# EAGLE design LoRa_Sensor (EAGLE 9.6.2)
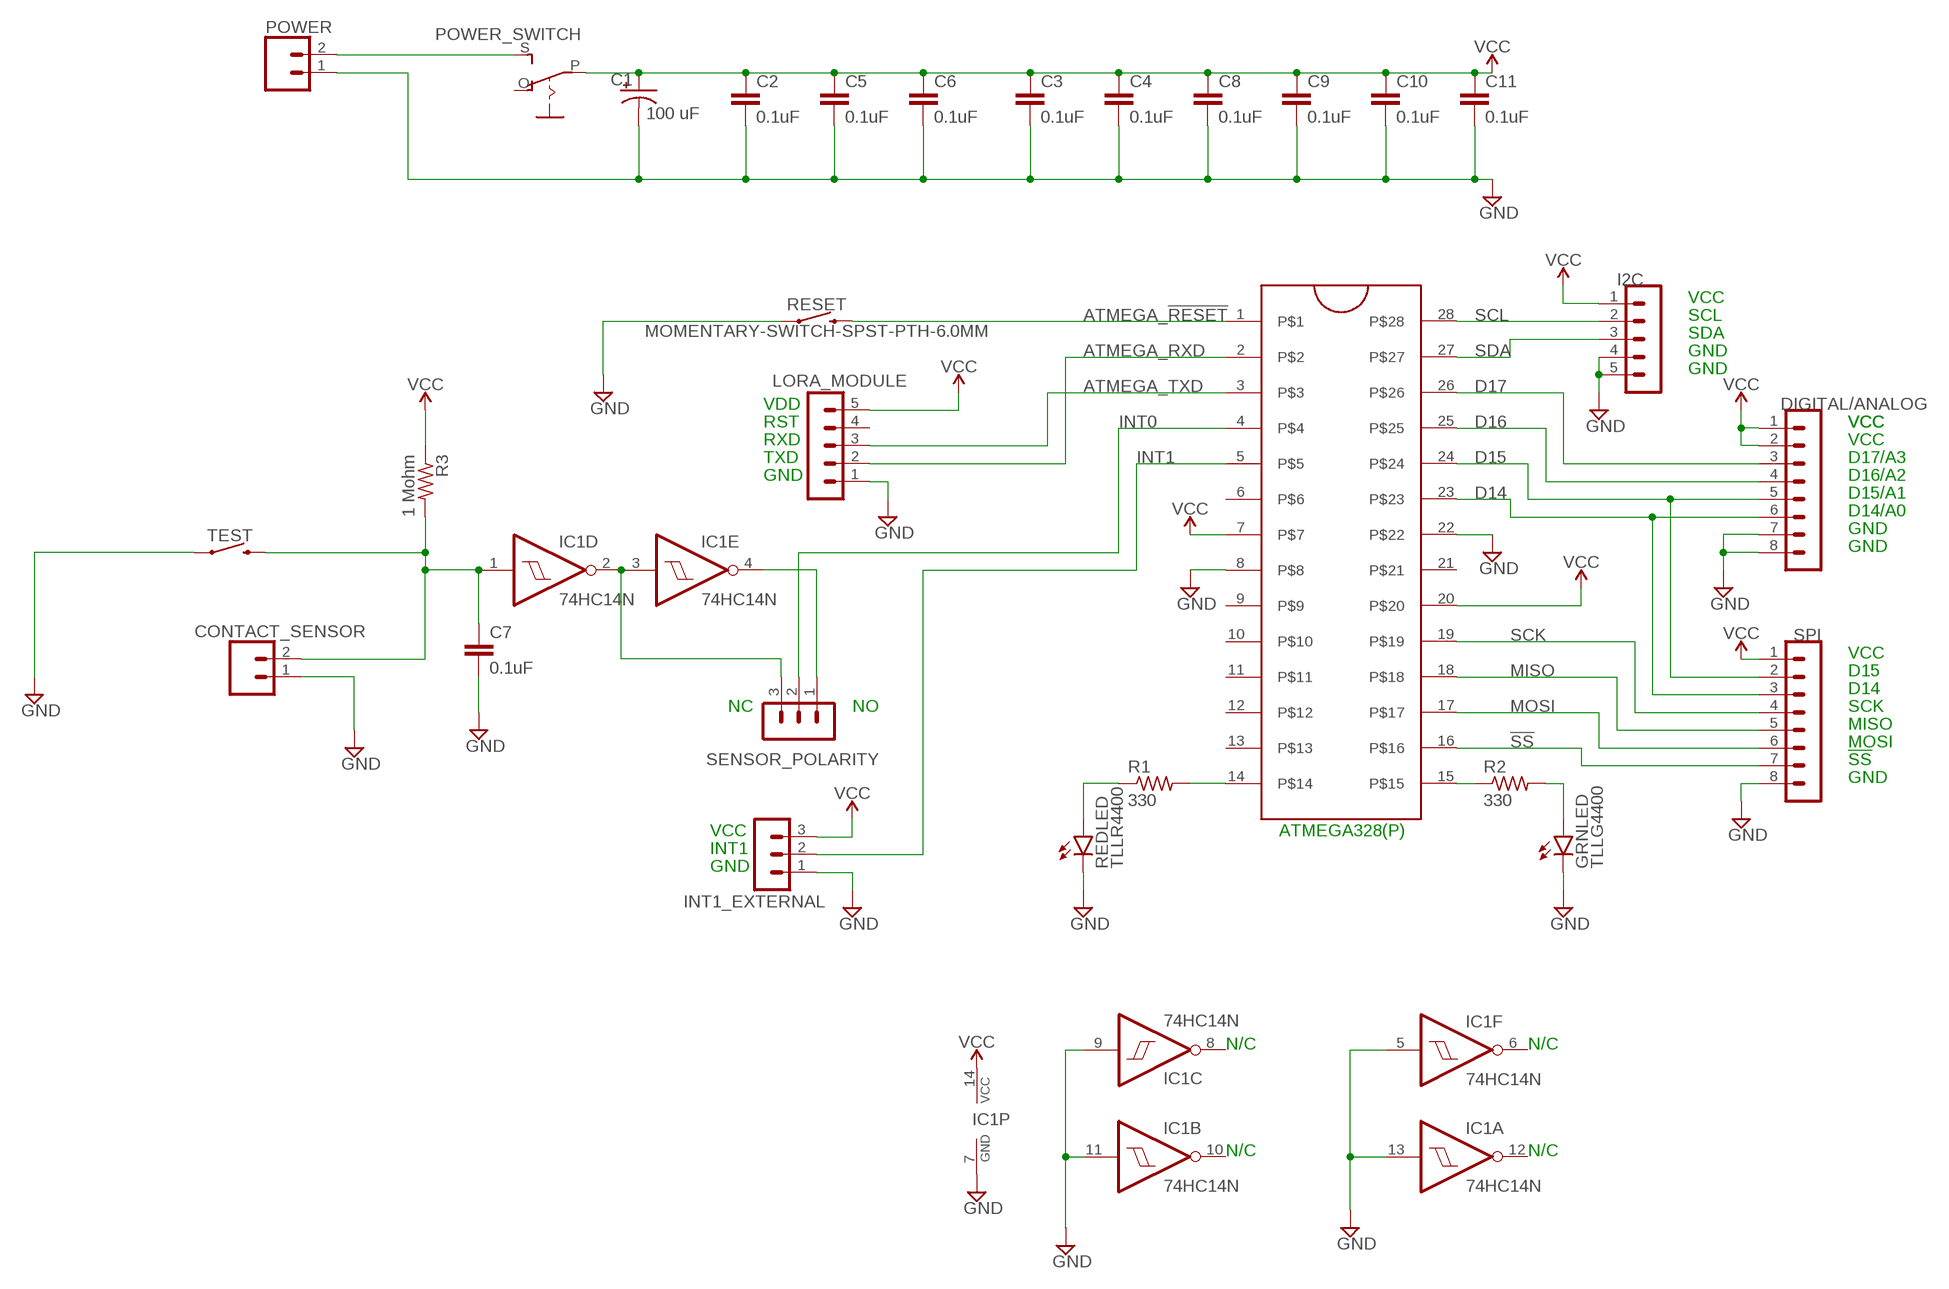
[diagram p0: schematic, sheet 1]

## Parts
C1  100 uF  CPOL-USE2.5-6  [E2,5-6]
C2  0.1uF  0.1UF-KIT-EZ-50V-20%  [CAP-PTH-SMALL-KIT]
C3  0.1uF  0.1UF-KIT-EZ-50V-20%  [CAP-PTH-SMALL-KIT]
C4  0.1uF  0.1UF-KIT-EZ-50V-20%  [CAP-PTH-SMALL-KIT]
C5  0.1uF  0.1UF-KIT-EZ-50V-20%  [CAP-PTH-SMALL-KIT]
C6  0.1uF  0.1UF-KIT-EZ-50V-20%  [CAP-PTH-SMALL-KIT]
C7  0.1uF  0.1UF-KIT-EZ-50V-20%  [CAP-PTH-SMALL-KIT]
C8  0.1uF  0.1UF-KIT-EZ-50V-20%  [CAP-PTH-SMALL-KIT]
C9  0.1uF  0.1UF-KIT-EZ-50V-20%  [CAP-PTH-SMALL-KIT]
C10  0.1uF  0.1UF-KIT-EZ-50V-20%  [CAP-PTH-SMALL-KIT]
C11  0.1uF  0.1UF-KIT-EZ-50V-20%  [CAP-PTH-SMALL-KIT]
CONTACT_SENSOR  CONN_023.5MM  [SCREWTERMINAL-3.5MM-2]
DIGITAL/ANALOG  MA08-1  [MA08-1]
GRNLED  TLLG4400  [LED3MM]
I2C  MA05-1  [MA05-1]
IC1  74HC14N  [DIL14]
INT1_EXTERNAL  MA03-1  [MA03-1]
J1  ZIFSOCKET-28-3"  [DIL28-3-ZIF_SOCKET]
LORA_MODULE  MA05-1  [MA05-1]
POWER  CONN_023.5MM  [SCREWTERMINAL-3.5MM-2]
POWER_SWITCH  EG1218S  [EG1218]
R1  330  R-US_0309/12  [0309/12]
R2  330  R-US_0309/12  [0309/12]
R3  1 Mohm  R-US_0309/12  [0309/12]
REDLED  TLLR4400  [LED3MM]
RESET  MOMENTARY-SWITCH-SPST-PTH-6.0MM  [TACTILE_SWITCH_PTH_6.0MM]
SENSOR_POLARITY  MA03-1  [MA03-1]
SPI  MA08-1  [MA08-1]
TEST  MOMENTARY-SWITCH-SPST-PTH-6.0MM  [TACTILE_SWITCH_PTH_6.0MM]

## Nets
!SS: J1.16 SPI.7
ATMEGA_!RESET: J1.1 RESET.3
ATMEGA_RXD: J1.2 LORA_MODULE.2
ATMEGA_TXD: J1.3 LORA_MODULE.3
D14: DIGITAL/ANALOG.6 J1.23 SPI.3
D15: DIGITAL/ANALOG.5 J1.24 SPI.2
D16: DIGITAL/ANALOG.4 J1.25
D17: DIGITAL/ANALOG.3 J1.26
GND: C1.- C2.2 C3.2 C4.2 C5.2 C6.2 C7.2 C8.2 C9.2 C10.2 C11.2 CONTACT_SENSOR.1 DIGITAL/ANALOG.7 DIGITAL/ANALOG.8 GRNLED.K(C) I2C.4 I2C.5 IC1.5(F:I) IC1.7(P:GND) IC1.9(C:I) IC1.11(B:I) IC1.13(A:I) INT1_EXTERNAL.1 J1.8 J1.22 LORA_MODULE.1 POWER.1 REDLED.K(C) RESET.1 SPI.8 TEST.1
INT0: J1.4 SENSOR_POLARITY.2
INT1: INT1_EXTERNAL.2 J1.5
MISO: J1.18 SPI.5
MOSI: J1.17 SPI.6
N$1: C7.1 CONTACT_SENSOR.2 IC1.1(D:I) R3.2 TEST.3
N$2: POWER.2 POWER_SWITCH.S
N$3: J1.15 R2.1
N$4: GRNLED.A R2.2
N$5: J1.14 R1.2
N$6: R1.1 REDLED.A
N$8: IC1.2(D:O) IC1.3(E:I) SENSOR_POLARITY.3
N$9: IC1.4(E:O) SENSOR_POLARITY.1
SCK: J1.19 SPI.4
SCL: I2C.2 J1.28
SDA: I2C.3 J1.27
VCC: C1.+ C2.1 C3.1 C4.1 C5.1 C6.1 C8.1 C9.1 C10.1 C11.1 DIGITAL/ANALOG.1 DIGITAL/ANALOG.2 I2C.1 IC1.14(P:VCC) INT1_EXTERNAL.3 J1.7 J1.20 LORA_MODULE.5 POWER_SWITCH.P R3.1 SPI.1
Unconnected: IC1.6(F:O) IC1.8(C:O) IC1.10(B:O) IC1.12(A:O) J1.6 J1.9 J1.10 J1.11 J1.12 J1.13 J1.21 LORA_MODULE.4 POWER_SWITCH.O

## Notes on the sheet
- VCC
- SCL
- SDA
- GND
- GND
- VDD
- RST | VCC | VCC
- RXD | VCC
- TXD | D17/A3
- GND | D16/A2
- D15/A1
- D14/A0
- GND
- GND
- VCC
- D15
- D14
- NC | NO | SCK
- MISO
- MOSI
- !SS
- GND
- VCC | ATMEGA328(P)
- INT1
- GND
- N/C | N/C
- N/C | N/C

## Library data of the parts
C1 = adafruit:CPOL-US: POLARIZED CAPACITOR, American symbol
C2-C11 = SparkFun-Capacitors:0.1UF: 0.1µF ceramic capacitors A capacitor is a passive two-terminal electrical component used to store electrical energy temporarily in an electric field.; PROD_ID: CAP-08370
CONTACT_SENSOR POWER = SparkFun-Connectors:CONN_02: Multi connection point. Often used as Generic Header-pin footprint for 0.1 inch spaced/style header connections On any of the 0.1 inch spaced packages, you can populate with these: Break Away Headers - Straight <https://www.sparkfun.com/products/116> (PRT-00116) Break Away Male Headers - Right Angle <https://www.sparkfun.com/products/553> (PRT-00553) Female Headers <https://www.sparkfun.com/products/115> (PRT-00115) Break Away Headers - Machine Pin <https://www.sparkfun.com/products/117> (PRT-00117) Break Away Female Headers - Swiss Machine Pin <https://www.sparkfun.com/products/743> (PRT-00743) For SCREWTERMINALS and SPRING TERMINALS visit here: Screw Terimnals on SparkFun.com <https://www.sparkfun.com/search/results?term=Screw+Terminals> (5mm/3.5mm/2.54mm spacing) This device is also useful as a general connection point to wire up your design to another part of your project. Our various solder wires solder well into these plated through hole pads. Hook-Up Wire - Assortment (Stranded, 22 AWG) <https://www.sparkfun.com/products/11375> (PRT-11375) Hook-Up Wire - Assortment (Solid Core, 22 AWG) <https://www.sparkfun.com/products/11367> (PRT-11367) View the entire wire category on our website here <https://www.sparkfun.com/categories/141> Special notes: Molex polarized connector foot print use with: PRT-08233 with associated crimp pins and housings. 2.54_SCREWTERM for use with PRT-10571. 3.5mm Screw Terminal footprints for PRT-08084 5mm Screw Terminal footprints for use with PRT-08432; PROD_ID: CONN-08399
DIGITAL/ANALOG SPI = con-lstb:MA08-1: PIN HEADER; OC_FARNELL: unknown; OC_NEWARK: unknown
GRNLED = led:TLLG4400: Low Current (2mA) LED 3 mm Tinted Diffused Package color GREEN Source: Data sheet <http://www.farnell.com/datasheets/391098.pdf>; MF: VISHAY SEMICONDUCTOR; OC_FARNELL: 1612435
I2C LORA_MODULE = con-lstb:MA05-1: PIN HEADER; OC_FARNELL: unknown; OC_NEWARK: unknown
IC1 = 74xx-eu:74*14: Hex schmitt trigger INVERTER
INT1_EXTERNAL SENSOR_POLARITY = con-lstb:MA03-1: PIN HEADER; OC_FARNELL: unknown; OC_NEWARK: unknown
J1 = SparkFun-Connectors:ZIFSOCKET-28-3: ZIF Socket 28-Pin 0.3" Lever-action ZIF socket for 28-pin ICs SparkFun Products: ZIF Socket 28-Pin <https://www.sparkfun.com/products/9175>; PROD_ID: CONN-10960; SF_ID: PRT-09175
POWER_SWITCH = adafruit:EG1218: SLIDING SWITCH 0.1" spacing through hole, vertical SPDT slide switch http://www.ladyada.net/library/pcb/eaglelibrary.html
R1-R3 = adafruit:R-US_: RESISTOR, American symbol
REDLED = led:TLLR4400: Low Current (2mA) LED 3 mm Tinted Diffused Package color RED Source: Data sheet <http://www.farnell.com/datasheets/391100.pdf>; MF: VISHAY SEMICONDUCTOR; OC_FARNELL: 1612437
RESET TEST = SparkFun-Switches:MOMENTARY-SWITCH-SPST: Momentary Switch (Pushbutton) - SPST Normally-open (NO) SPST momentary switches (buttons, pushbuttons). Variants PTH-12MM - 12mm square, through-hole Momentary Pushbutton Switch - 12mm Square <https://www.sparkfun.com/products/9190> (COM-09190) PTH-6.0MM, PTH-6.0MM-KIT - 6.0mm square, through-hole Mini Pushbutton Switch <https://www.sparkfun.com/products/97> (COM-00097) KIT package intended for soldering kit's - only one side of pads' copper is exposed. PTH-RIGHT-ANGLE-KIT - Right-angle, through-hole Right Angle Tactile Button <https://www.sparkfun.com/products/10791> - Used on SparkFun BigTime Watch Kit <https://www.sparkfun.com/products/11734> SMD-12MM - 12mm square, surface-mount Tactile Button - SMD (12mm) <https://www.sparkfun.com/products/12993> (COM-12993) Used on SparkFun PicoBoard <https://www.sparkfun.com/products/11888> SMD-4.5MM - 4.5mm Square Trackball Switch Used on SparkFun Blackberry Trackballer Breakout <https://www.sparkfun.com/products/13169> SMD-4.6MMX2.8MM - 4.60mm x 2.80mm, surface mount Used on SparkFun SAMD21 Mini Breakout <https://www.sparkfun.com/products/13664> SMD-5.2MM, SMD-5.2-REDUNDANT - 5.2mm square, surface-mount Mini Pushbutton Switch - SMD <https://www.sparkfun.com/products/8720> (COM-08720) Used on Arduino Pro Mini <https://www.sparkfun.com/products/11114> REDUNDANT package connects both switch circuits together SMD-6.0X3.5MM - 6.0 x 3.5mm, surface mount Momentary Reset Switch SMD <https://www.sparkfun.com/products/8229> (COM-08229) SMD-6.2MM-TALL - 6.2mm square, surface mount Tactile Button - SMD (6mm) <https://www.sparkfun.com/products/12992> Used on SparkFun Digital Sandbox <https://www.sparkfun.com/products/12651> SMD-RIGHT-ANGLE - Right-angle, surface mount Used on SparkFun Block for Intel® Edison - Arduino <https://www.sparkfun.com/products/13036>; PROD_ID: SWCH-08441; SF_SKU: COM-00097

## Board
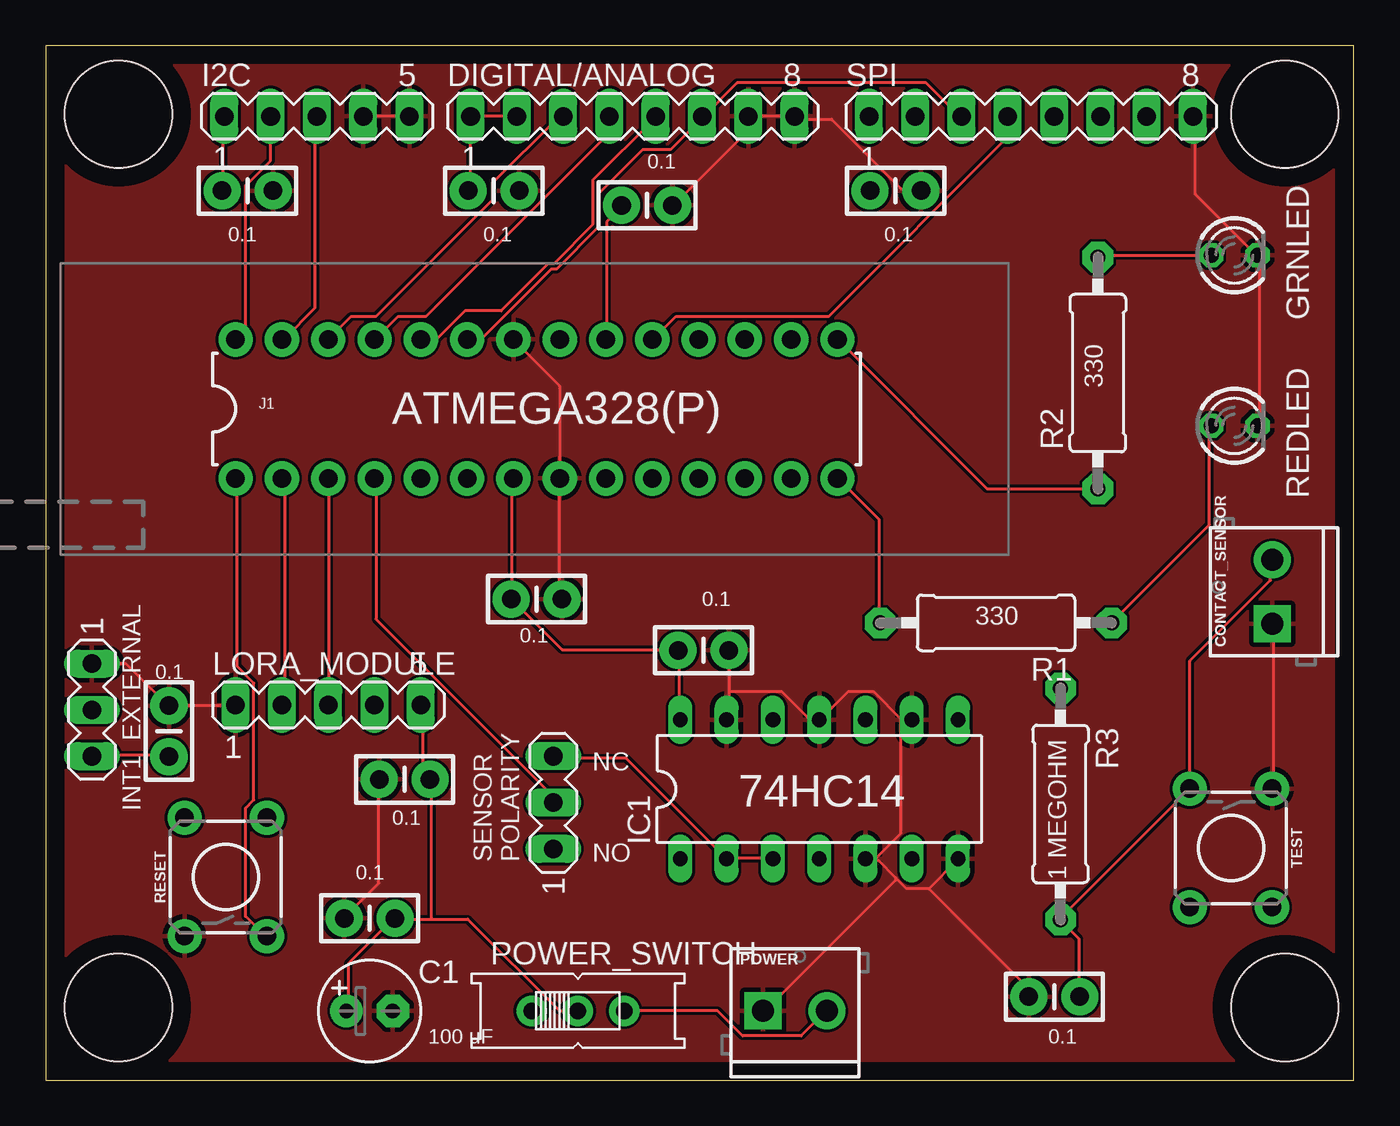
[diagram p1: board, top side]
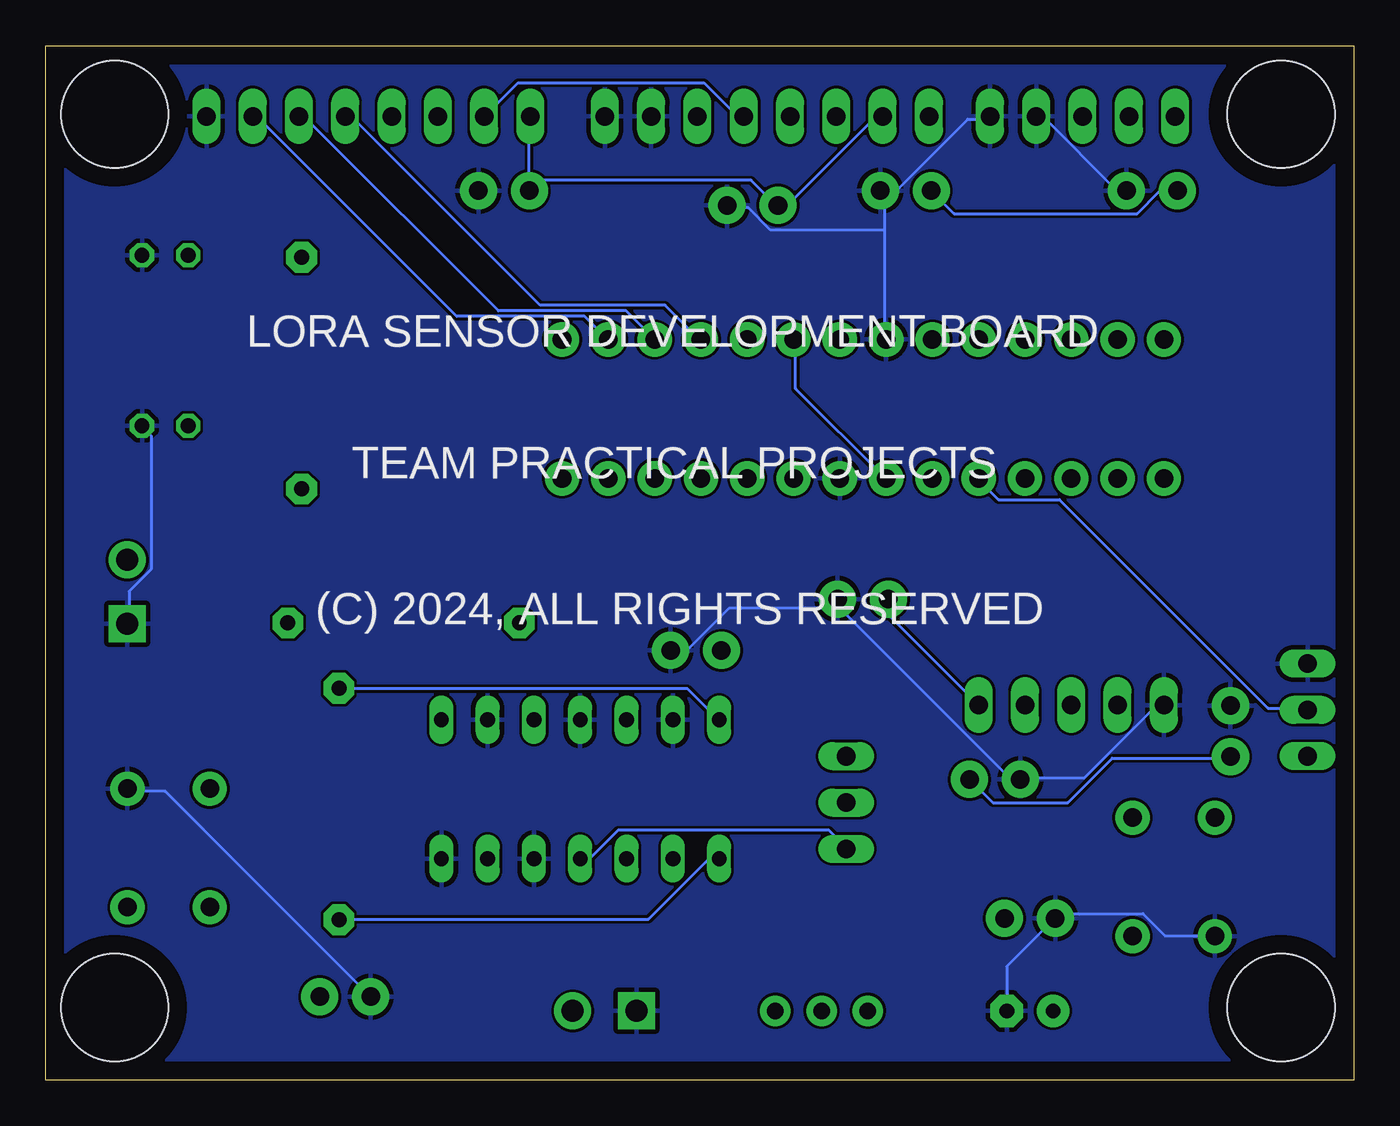
[diagram p2: board, bottom side, seen from below]

Size 71.79 x 56.76 mm. Coordinates in mm from the lower left corner, seen from the top.
Outline: 0,0 71.79,0 71.79,56.76 0,56.76 0,0
Copper layers (1*16): Top 0.035mm / dielectric 1.5mm / Bottom 0.035mm
Design rules "default": minimum track width 6mil, minimum drill 0.35mm, track to track 6mil, track to pad 6mil, pad to pad 6mil, via to via 6mil, smd to smd 6mil, copper to edge 40mil, drill to drill 6mil, minimum pad ring 10mil, minimum via ring 8mil, stop-mask expansion 4mil, vias tented up to drill 0mil, thermal gap 10mil
Holes 5.89 mm at 4,4 68,4 68,53 4,53

### Footprints (pad centres in the part's own frame; a part is rotated, then mirrored left to right if it is on the bottom)
E2,5-6 = drill 0.813 pad 1.778: + -1.27,0 | drill 0.813 pad 1.778 octagon: - 1.27,0
CAP-PTH-SMALL-KIT = drill 1.016 pad 2.032: 1 -1.397,0; 2 1.397,0
SCREWTERMINAL-3.5MM-2 = drill 1.2 pad 2.032 square: 1 0,0 | drill 1.2 pad 2.032: 2 3.5,0
MA08-1 = drill 1.016 long: 1 -8.89,0; 2 -6.35,0; 3 -3.81,0; 4 -1.27,0; 5 1.27,0; 6 3.81,0; 7 6.35,0; 8 8.89,0
LED3MM = drill 0.813 octagon: A -1.27,0; K 1.27,0
MA05-1 = drill 1.016 long: 1 -5.08,0; 2 -2.54,0; 3 0,0; 4 2.54,0; 5 5.08,0
DIL14 = drill 0.813 long: 1 -7.62,-3.81; 2 -5.08,-3.81; 3 -2.54,-3.81; 4 0,-3.81; 5 2.54,-3.81; 6 5.08,-3.81; 7 7.62,-3.81; 8 7.62,3.81; 9 5.08,3.81; 10 2.54,3.81; 11 0,3.81; 12 -2.54,3.81; 13 -5.08,3.81; 14 -7.62,3.81
MA03-1 = drill 1.016 long: 1 -2.54,0; 2 0,0; 3 2.54,0
DIL28-3-ZIF_SOCKET = drill 1.016 pad 1.88: 1 -16.51,-3.81; 2 -13.97,-3.81; 3 -11.43,-3.81; 4 -8.89,-3.81; 5 -6.35,-3.81; 6 -3.81,-3.81; 7 -1.27,-3.81; 8 1.27,-3.81; 9 3.81,-3.81; 10 6.35,-3.81; 11 8.89,-3.81; 12 11.43,-3.81; 13 13.97,-3.81; 14 16.51,-3.81; 15 16.51,3.81; 16 13.97,3.81; 17 11.43,3.81; 18 8.89,3.81; 19 6.35,3.81; 20 3.81,3.81; 21 1.27,3.81; 22 -1.27,3.81; 23 -3.81,3.81; 24 -6.35,3.81; 25 -8.89,3.81; 26 -11.43,3.81; 27 -13.97,3.81; 28 -16.51,3.81
EG1218 = drill 0.9 pad 1.676: O -2.54,0; P 0,0; S 2.54,0
0309/12 = drill 0.813 pad 1.676 octagon: 1 -6.35,0; 2 6.35,0
TACTILE_SWITCH_PTH_6.0MM = drill 1.016 pad 1.88: 1 -3.251,2.261; 2 3.251,2.261; 3 -3.251,-2.261; 4 3.251,-2.261

### Placement (x,y rotation side)
C1  17.78,3.81 0 top
C2  11.08,48.8 0 top
C3  17.78,8.89 180 top
C4  26.94,26.4 0 top
C5  19.7,16.51 180 top
C6  6.77,19.16 90 top
C7  55.35,4.59 180 top
C8  24.59,48.8 0 top
C9  36.1,23.59 0 top
C10  46.64,48.8 0 top
C11  33,48 0 top
CONTACT_SENSOR  67.31,25.05 90 top
DIGITAL/ANALOG  32.21,52.88 0 top
GRNLED  65.23,45.26 0 top
I2C  14.89,52.88 0 top
IC1  42.45,15.97 0 top
INT1_EXTERNAL  2.54,20.32 270 top
J1  26.94,36.83 0 top
LORA_MODULE  15.51,20.59 0 top
POWER  39.37,3.81 0 top
POWER_SWITCH  29.21,3.81 0 top
R1  52.15,25.1 180 top
R2  57.74,38.8 90 top
R3  55.69,15.16 270 top
REDLED  65.23,35.91 0 top
RESET  9.89,11.16 90 top
SENSOR_POLARITY  27.86,15.24 90 top
SPI  54.07,52.88 0 top
TEST  65.04,12.75 270 top

### Tracks (layer width: path | path; a pad name or v marks a point on that pad's centre or on a via)
!SS
  Bottom 0.152: SPI.7 60.35,52.73 60.05,52.73 49.23,41.91 42.22,41.91 41,40.69 J1.16
ATMEGA_!RESET
  Top 0.152: J1.1 10.52,32.92 10.52,22.71 11.43,21.79 11.43,15.39 10.97,14.94 10.97,8.99 12.04,7.92 RESET.3
ATMEGA_RXD
  Top 0.152: LORA_MODULE.2 13.11,20.73 13.11,32.92 J1.2
ATMEGA_TXD
  Top 0.152: LORA_MODULE.3 15.54,20.73 15.54,32.92 J1.3
D14
  Top 0.152: SPI.3 50.14,52.88 48.31,54.71 37.95,54.71 36.12,52.88 DIGITAL/ANALOG.6 35.97,52.73 34.29,51.05 32.77,51.05 30.33,48.62 30.33,46.79 28.04,44.5 27.74,44.5 23.93,40.69 23.16,40.69 J1.23
D15
  Top 0.152: J1.24 20.73,40.69 21.49,40.69 23.01,42.22 24.99,42.22 27.58,44.81 27.89,44.81 30.02,46.94 30.02,49.38 33.38,52.73 DIGITAL/ANALOG.5
  Bottom 0.152: DIGITAL/ANALOG.5 33.53,52.88 33.83,52.88 35.66,54.71 45.87,54.71 47.7,52.88 SPI.2
D16
  Top 0.152: DIGITAL/ANALOG.4 30.94,52.73 30.94,51.97 20.88,41.91 19.36,41.91 18.14,40.69 J1.25
D17
  Top 0.152: DIGITAL/ANALOG.3 28.35,52.73 28.04,52.73 24.54,49.23 24.54,48.31 18.14,41.91 16.76,41.91 15.54,40.69 J1.26
GND
  Top 0.152: TEST.1 67.36,16 67.36,24.99 CONTACT_SENSOR.1 | REDLED.K 66.6,35.97 66.6,45.11 GRNLED.K 66.45,45.26 63.09,48.62 63.09,52.73 SPI.8 | 37.49,21.34 37.49,23.47 C9.2 | 37.49,21.34 37.49,19.81 IC1.13 | 37.49,21.34 40.39,21.34 41.91,19.81 42.37,19.81 IC1.11 42.52,19.81 44.04,21.34 45.41,21.34 46.94,19.81 | 46.94,19.81 47.4,19.81 IC1.9 46.94,19.81 | 45.41,12.04 45.72,12.04 46.63,11.12 | 45.41,12.04 45.11,12.04 IC1.5 45.41,12.04 | 46.63,11.12 47.24,10.52 48.46,10.52 | 48.46,10.52 49.99,12.04 IC1.7 | 46.63,11.12 46.63,10.97 39.47,3.81 POWER.1 | 48.46,10.52 53.95,5.03 53.95,4.72 C7.2 | 46.94,19.81 46.94,13.56 45.41,12.04 | INT1_EXTERNAL.1 4.42,22.86 6.71,20.57 C6.2 6.86,20.57 10.36,20.57 LORA_MODULE.1 | C5.2 18.29,16.46 18.29,10.82 16.46,8.99 C3.2 | C11.2 34.44,48.01 38.56,52.12 38.56,52.73 DIGITAL/ANALOG.7 38.71,52.88 41,52.88 DIGITAL/ANALOG.8 41.15,52.73 43.13,52.73 46.94,48.92 48.01,48.92 C10.2 | I2C.4 17.53,52.88 I2C.5 | C4.2 28.19,26.52 28.19,32.92 J1.8 28.19,33.07 28.19,38.1 25.76,40.54 J1.22
  Bottom 0.152: CONTACT_SENSOR.1 67.21,25.15 67.21,26.82 65.99,28.04 65.99,35.36 66.45,35.81 REDLED.K | C1.- 19.05,6.25 16.46,8.84 C3.2 16.31,8.99 16.15,9.14 11.58,9.14 10.36,7.92 7.77,7.92 RESET.1 | LORA_MODULE.1 10.52,20.57 10.82,20.57 14.78,16.61 18.29,16.61 C5.2 18.44,16.61 18.9,16.61 28.19,25.91 | I2C.4 17.37,52.73 16.92,52.73 13.11,48.92 12.5,48.92 C2.2 | 25.76,48.62 25.76,46.63 | 25.76,46.63 25.76,40.69 J1.22 | 25.76,48.62 25.91,48.77 C8.2 25.76,48.62 | 25.76,48.62 25.3,48.62 21.18,52.73 20.12,52.73 I2C.5 | 25.76,46.63 32,46.63 33.22,47.85 34.29,47.85 C11.2 | 28.19,25.91 28.19,26.36 C4.2 28.19,25.91 | 28.19,25.91 34.29,25.91 36.58,23.62 37.49,23.62 C9.2 | TEST.1 67.21,15.85 65.23,15.85 54.1,4.72 C7.2
  pour Top (isolate 0.012): 0,0 72,0 72,57 0,57
  pour Bottom (isolate 0.012): 0,0 72,0 72,57 0,57
INT0
  Top 0.152: SENSOR_POLARITY.2 27.74,15.24 27.74,15.7 18.14,25.3 18.14,32.92 J1.4
INT1
  Bottom 0.152: INT1_EXTERNAL.2 2.59,20.42 4.72,20.42 16.15,31.85 19.51,31.85 20.57,32.92 J1.5
MISO
  Bottom 0.152: SPI.5 55.32,52.73 54.86,52.73 44.65,42.52 37.8,42.52 35.97,40.69 J1.18
MOSI
  Bottom 0.152: SPI.6 57.76,52.73 57.45,52.73 46.94,42.22 39.93,42.22 38.41,40.69 J1.17
N$1
  Top 0.152: C7.1 56.69,4.72 56.69,7.77 55.78,8.69 R3.2 55.63,8.84 62.64,15.85 TEST.3 62.79,23.01 67.21,27.43 67.21,28.5 CONTACT_SENSOR.2
  Bottom 0.152: IC1.1 34.9,12.04 35.51,12.04 38.71,8.84 55.63,8.84 R3.2
N$2
  Top 0.152: POWER_SWITCH.S 36.88,3.81 38.25,2.44 41.45,2.44 42.82,3.81 POWER.2
N$3
  Top 0.152: R2.1 57.61,32.46 51.66,32.46 43.59,40.54 J1.15
N$4
  Top 0.152: GRNLED.A 63.86,45.26 57.76,45.26 R2.2
N$5
  Top 0.152: R1.2 45.72,25.15 45.72,30.79 43.59,32.92 J1.14
N$6
  Top 0.152: REDLED.A 63.86,35.81 63.86,30.48 58.52,25.15 R1.1
N$8
  Top 0.152: IC1.3 39.78,12.19 37.49,12.19 IC1.2 31.85,17.68 27.89,17.68 SENSOR_POLARITY.3
N$9
  Bottom 0.152: IC1.4 42.37,12.19 41.91,12.19 40.39,13.72 28.8,13.72 27.89,12.8 SENSOR_POLARITY.1
SCK
  Top 0.152: SPI.4 52.73,52.73 52.73,51.66 42.98,41.91 34.59,41.91 33.38,40.69 J1.19
SCL
  Top 0.152: I2C.2 12.34,52.73 12.34,50.44 10.97,49.07 10.97,41.15 10.52,40.69 J1.28
SDA
  Top 0.152: I2C.3 14.78,52.73 14.78,42.37 13.11,40.69 J1.27
VCC
  Top 0.152: I2C.1 9.75,52.73 9.75,48.92 C2.1 | DIGITAL/ANALOG.2 25.76,52.88 23.47,52.88 DIGITAL/ANALOG.1 23.32,52.73 23.32,48.92 C8.1 | J1.20 30.79,40.69 30.79,47.09 31.55,47.85 C11.1 | IC1.14 34.75,19.81 34.75,23.47 C9.1 34.59,23.62 28.35,23.62 25.6,26.36 C4.1 25.6,26.52 25.6,32.92 J1.7 | INT1_EXTERNAL.3 2.59,17.83 6.71,17.83 C6.1 | LORA_MODULE.5 20.73,20.57 20.73,16.92 21.03,16.61 C5.1 21.18,16.46 21.18,8.84 | POWER_SWITCH.P 28.19,3.81 23.16,8.84 21.18,8.84 | 21.18,8.84 19.2,8.84 C3.1 19.05,8.84 16.61,6.4 16.61,3.81 C1.+
  Bottom 0.152: C2.1 9.75,48.77 10.67,48.77 11.89,47.55 21.95,47.55 23.16,48.77 C8.1 | 45.26,49.38 45.26,48.92 C10.1 45.26,49.38 | 45.26,49.38 45.26,52.73 SPI.1 | 45.26,49.38 33.07,49.38 31.7,48.01 C11.1 31.55,48.01 31.09,48.01 26.36,52.73 25.91,52.73 DIGITAL/ANALOG.2 | R3.1 55.63,21.49 36.58,21.49 34.9,19.81 IC1.14 | C6.1 6.86,17.68 13.26,17.68 15.7,15.24 19.81,15.24 21.03,16.46 C5.1 | LORA_MODULE.5 25.45,25.45 25.45,26.36 C4.1 | J1.20 30.63,40.54 30.63,37.95 25.76,33.07 J1.7

### Text on the board
tPlace: 0.1 | 0.1 | 0.1 | 0.1 | 330 | ATMEGA328(P) | 0.1 | 330 | 0.1 | 0.1 | NC | 74HC14 | 0.1 | SENSOR / POLARITY | NO | 0.1 | 1 MEGOHM | 100 uF | 0.1
bPlace: LORA SENSOR DEVELOPMENT BOARD | TEAM PRACTICAL PROJECTS | (C) 2024, ALL RIGHTS RESERVED